# EAGLE schematic RedBoard_ESP32 (EAGLE 9.6.2)
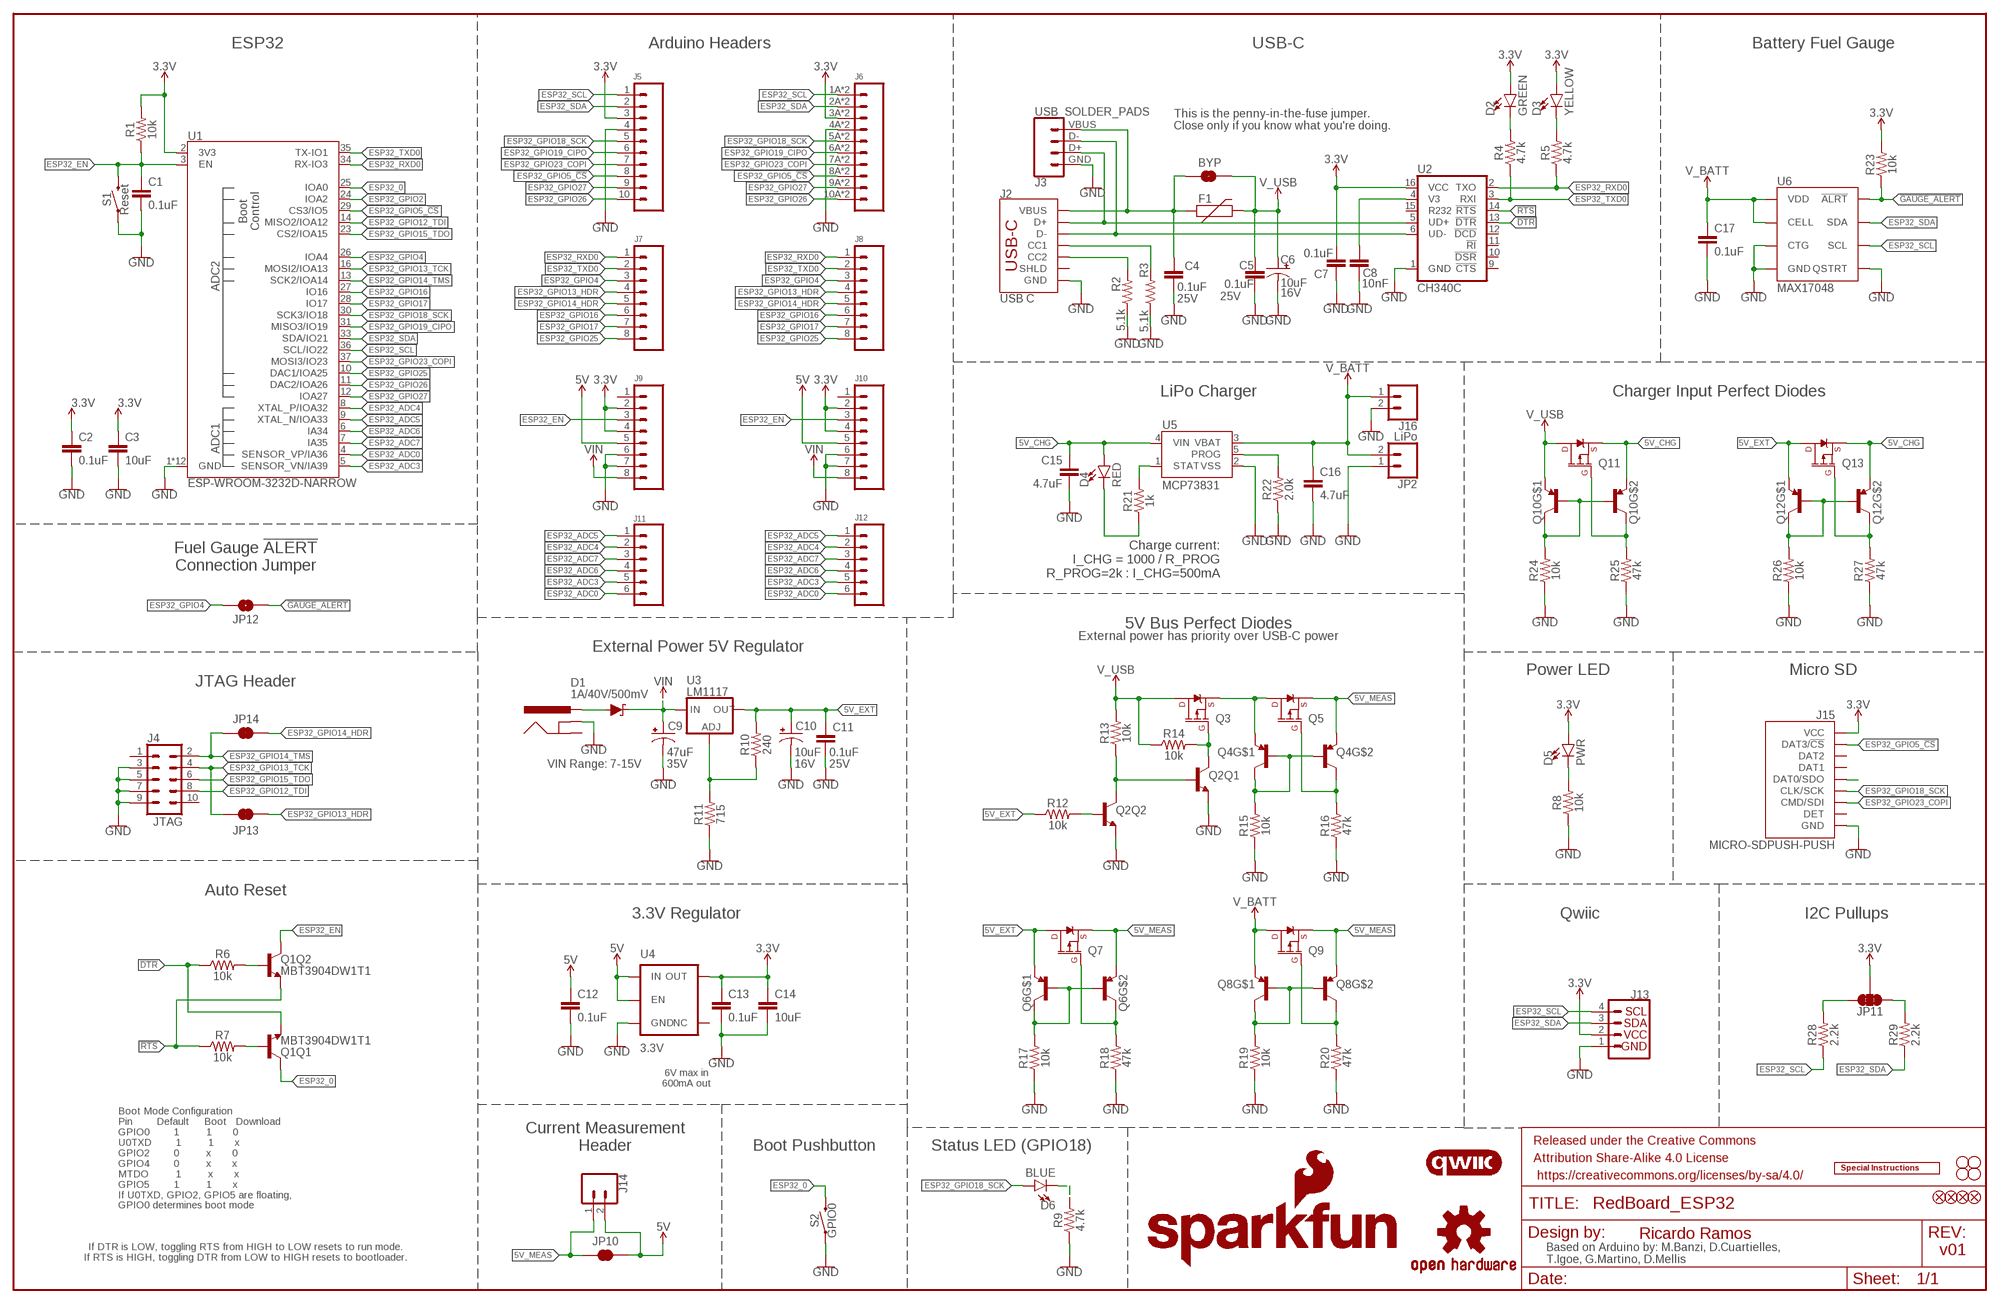
[diagram p0: schematic, sheet 1]

## Parts
BYP  JUMPER-SMT_2_NO_SILK  [SMT-JUMPER_2_NO_SILK]
C1  0.1uF  0.1UF-0603-25V-(+80/-20%)  [0603]
C2  0.1uF  0.1UF-0603-25V-(+80/-20%)  [0603]
C3  10uF  10UF-0603-6.3V-20%  [0603]
C4  0.1uF  0.1UF-0603-25V-(+80/-20%)  [0603]
C5  0.1uF  0.1UF-0603-25V-(+80/-20%)  [0603]
C6  10uF  10UF-POLAR-EIA3216-16V-10%(TANT)  [EIA3216]
C7  0.1uF  0.1UF-0603-25V-(+80/-20%)  [0603]
C8  10nF  10NF-0603-50V-10%  [0603]
C9  47uF  47UF-POLAR-PANASONIC_D-35V-20%  [PANASONIC_D]
C10  10uF  10UF-POLAR-EIA3216-16V-10%(TANT)  [EIA3216]
C11  0.1uF  0.1UF-0603-25V-(+80/-20%)  [0603]
C12  0.1uF  0.1UF-0603-25V-(+80/-20%)  [0603]
C13  0.1uF  0.1UF-0603-25V-(+80/-20%)  [0603]
C14  10uF  10UF-0603-6.3V-20%  [0603]
C15  4.7uF  4.7UF-0603-35V-(20%)  [0603]
C16  4.7uF  4.7UF-0603-35V-(20%)  [0603]
C17  0.1uF  0.1UF-0603-25V-(+80/-20%)  [0603]
D1  1A/40V/500mV  DIODE-SCHOTTKY-SS14  [SMA-DIODE]
D2  GREEN  LED-GREEN_HIDDENSILK  [LED-1206-HIDDENSILK]
D3  YELLOW  LED-YELLOW_HIDDENSILK  [LED-1206-HIDDENSILK]
D4  RED  LED-RED_HIDDENSILK  [LED-1206-HIDDENSILK]
D5  PWR  LED-GREEN_HIDDENSILK  [LED-1206-HIDDENSILK]
D6  BLUE  LED-BLUE_HIDDENSILK  [LED-1206-HIDDENSILK]
F1  6V/2A  PPTC_6V2A  [1210]
FRAME1  FRAME-LEDGER  [CREATIVE_COMMONS]
J1  5.5x2.1mm Barrel  POWER_JACKSMD  [POWER_JACK_SMD]
J2  USB C  USB_C_2-LAYER_PADS  [USB-C-16P-2LAYER-PADS]
J3  USB_SOLDER_PADS  [USB-SOLDER-PADS]
J4  CONN_05X20.05_IN_PTH_SILK  [2X5_PTH_SILK_.05]
J5  M10NO_SILK  CONN_10NO_SILK_PTH_FEMALE  [1X10_NO_SILK]
J6  CONN_10SMD_COMBO-FEMALE  [1X10_SMD_COMBINED]
J7  CONN_08NO_SILK_FEMALE_PTH  [1X08_NO_SILK]
J8  CONN_08SMD-COMBO-FEMALE  [1X08_SMD_COMBINED]
J9  CONN_08NO_SILK_FEMALE_PTH  [1X08_NO_SILK]
J10  CONN_08SMD-COMBO-FEMALE  [1X08_SMD_COMBINED]
J11  CONN_06NO_SILK_FEMALE_PTH  [1X06_NO_SILK]
J12  CONN_06SMD-STRAIGHT-COMBO-FEMALE  [1X06_SMD_STRAIGHT_COMBO]
J13  QWIIC_RIGHT_ANGLE  QWIIC_CONNECTORJS-1MM  [JST04_1MM_RA]
J14  CONN_02  [1X02]
J15  MICRO-SDPUSH-PUSH  [MICRO-SD-SOCKET]
J16  CONN_02  [1X02]
JP1  FIDUCIAL1X2  [FIDUCIAL-1X2]
JP2  LiPo  CONN_02-JST-2MM-SMT  [JST-2-SMD]
JP3  STAND-OFF  [STAND-OFF]
JP4  STAND-OFF  [STAND-OFF]
JP5  STAND-OFF  [STAND-OFF]
JP6  STAND-OFF  [STAND-OFF]
JP7  FIDUCIAL1X2  [FIDUCIAL-1X2]
JP8  FIDUCIAL1X2  [FIDUCIAL-1X2]
JP9  FIDUCIAL1X2  [FIDUCIAL-1X2]
JP10  JUMPER-SMT_2_NC_TRACE_SILK  [SMT-JUMPER_2_NC_TRACE_SILK]
JP11  JUMPER-SMT_3_2-NC_TRACE_SILK  [SMT-JUMPER_3_2-NC_TRACE_SILK]
JP12  JUMPER-SMT_2_NO_SILK  [SMT-JUMPER_2_NO_SILK]
JP13  JUMPER-SMT_2_NC_TRACE_SILK  [SMT-JUMPER_2_NC_TRACE_SILK]
JP14  JUMPER-SMT_2_NC_TRACE_SILK  [SMT-JUMPER_2_NC_TRACE_SILK]
LOGO1  SFE_LOGO_NAME.1_INCH  [SFE_LOGO_NAME_.1]
LOGO2  QWIIC_LOGO_5MM  [QWIIC_5MM]
LOGO3  OSHW-LOGOMINI  [OSHW-LOGO-MINI]
LOGO4  QWIIC_LOGO_5MM  [QWIIC_5MM]
LOGO5  SPECIAL_INSTRUCTIONS-ORDERING  [ORDERING_INSTRUCTIONS]
LOGO6  SFE_LOGO_NAME_FLAME.2_INCH  [SFE_LOGO_NAME_FLAME_.2]
Q1  MBT3904DW1T1  TRANS_NPN_DUAL-MBT3904DW1T1  [SC70-6]
Q2  TRANS_NPN_DUAL-MBT3904DW1T1  [SC70-6]
Q3  20V/4.2A/52mΩ/1.4W  MOSFET_PCH-DMG2305UX-7  [SOT23-3]
Q4  TRANS_PNP_DUALSOT-363  [SOT363_PHILIPS]
Q5  20V/4.2A/52mΩ/1.4W  MOSFET_PCH-DMG2305UX-7  [SOT23-3]
Q6  TRANS_PNP_DUALSOT-363  [SOT363_PHILIPS]
Q7  20V/4.2A/52mΩ/1.4W  MOSFET_PCH-DMG2305UX-7  [SOT23-3]
Q8  TRANS_PNP_DUALSOT-363  [SOT363_PHILIPS]
Q9  20V/4.2A/52mΩ/1.4W  MOSFET_PCH-DMG2305UX-7  [SOT23-3]
Q10  TRANS_PNP_DUALSOT-363  [SOT363_PHILIPS]
Q11  20V/4.2A/52mΩ/1.4W  MOSFET_PCH-DMG2305UX-7  [SOT23-3]
Q12  TRANS_PNP_DUALSOT-363  [SOT363_PHILIPS]
Q13  20V/4.2A/52mΩ/1.4W  MOSFET_PCH-DMG2305UX-7  [SOT23-3]
R1  10k  10KOHM-0603-1/10W-1%  [0603]
R2  5.1k  5.1KOHM5.1KOHM-0603-1/10W-1%  [0603]
R3  5.1k  5.1KOHM5.1KOHM-0603-1/10W-1%  [0603]
R4  4.7k  4.7KOHM-0603-1/10W-1%  [0603]
R5  4.7k  4.7KOHM-0603-1/10W-1%  [0603]
R6  10k  10KOHM-0603-1/10W-1%  [0603]
R7  10k  10KOHM-0603-1/10W-1%  [0603]
R8  10k  10KOHM-0603-1/10W-1%  [0603]
R9  4.7k  4.7KOHM-0603-1/10W-1%  [0603]
R10  240  240OHM-0603-1/10W-1%  [0603]
R11  715  715OHM-0603-1/10W-1%  [0603]
R12  10k  10KOHM-0603-1/10W-1%  [0603]
R13  10k  10KOHM-0603-1/10W-1%  [0603]
R14  10k  10KOHM-0603-1/10W-1%  [0603]
R15  10k  10KOHM-0603-1/10W-1%  [0603]
R16  47k  47KOHM-0603-1/10W-1%  [0603]
R17  10k  10KOHM-0603-1/10W-1%  [0603]
R18  47k  47KOHM-0603-1/10W-1%  [0603]
R19  10k  10KOHM-0603-1/10W-1%  [0603]
R20  47k  47KOHM-0603-1/10W-1%  [0603]
R21  1k  1KOHM-0603-1/10W-1%  [0603]
R22  2.0k  2.0KOHM-0603-1/10W-5%  [0603]
R23  10k  10KOHM-0603-1/10W-1%  [0603]
R24  10k  10KOHM-0603-1/10W-1%  [0603]
R25  47k  47KOHM-0603-1/10W-1%  [0603]
R26  10k  10KOHM-0603-1/10W-1%  [0603]
R27  47k  47KOHM-0603-1/10W-1%  [0603]
R28  2.2k  2.2KOHM-0603-1/10W-1%  [0603]
R29  2.2k  2.2KOHM-0603-1/10W-1%  [0603]
S1  Reset  MOMENTARY-SWITCH-SPST-SMD-5.2-TALL-REDUNDANT  [TACTILE_SWITCH_SMD_5.2MM]
S2  GPIO0  MOMENTARY-SWITCH-SPST-SMD-5.2-TALL-REDUNDANT  [TACTILE_SWITCH_SMD_5.2MM]
U1  ESP-WROOM-3232D-NARROW  [ESP-WROOM-32D-NARROW]
U2  CH340C  [SO016]
U3  LM1117  V_REG_LM1117SOT223  [SOT223]
U4  3.3V  V_REG_AP2112K-3.3V  [SOT23-5]
U5  MCP73831  [SOT23-5]
U6  MAX17048  MAX17048DFN8  [DFN-8]

## Nets
3.3V: C2.1 C3.1 C7.1 C13.1 C14.1 D2.A D3.A D5.A J5.3 J6.3A J6.3B J9.2 J9.4 J10.2 J10.4 J13.2 J15.VCC JP11.2 R1.2 R23.2 U1.2(3V3) U2.16(VCC) U4.5(OUT)
5V [power]: C12.1 J9.5 J10.5 J14.2 JP10.2 U4.1(IN) U4.3(EN)
5V_CHG: C15.1 D4.A Q10.4(E) Q11.2(S) Q12.4(E) Q13.2(S) U5.4(VIN)
5V_EXT [power]: C10.+ C11.1 Q6.1(E) Q7.3(D) Q12.1(E) Q13.3(D) R10.2 R12.1 U3.2(OUT) U3.4(OUT)
5V_MEAS: J14.1 JP10.1 Q4.4(E) Q5.2(S) Q6.4(E) Q7.2(S) Q8.4(E) Q9.2(S)
!DTR!: Q1.4(Q1:E) R6.1 U2.13(!DTR)
!GAUGE_ALERT!: JP12.1 R23.1 U6.5(!ALRT)
!RTS!: Q1.1(Q2:E) R7.1 U2.14(!RTS)
CC1: J2.A5(CC1) R3.2
CC2: J2.B5(CC2) R2.2
D+: J2.A6(D+) J2.B6(D+) J3.D+ U2.5(UD+)
D-: J2.A7(D-) J2.B7(D-) J3.D- U2.6(UD-)
ESP32_0: Q1.3(Q1:C) S2.3 S2.4 U1.25(IOA0)
ESP32_ADC0: J11.6 J12.6 U1.4(SENSOR_VP/IA36)
ESP32_ADC3: J11.5 J12.5 U1.5(SENSOR_VN/IA39)
ESP32_ADC4: J11.2 J12.2 U1.8(XTAL_P/IOA32)
ESP32_ADC5: J11.1 J12.1 U1.9(XTAL_N/IOA33)
ESP32_ADC6: J11.4 J12.4 U1.6(IA34)
ESP32_ADC7: J11.3 J12.3 U1.7(IA35)
ESP32_EN: C1.1 J9.3 J10.3 Q1.6(Q2:C) R1.1 S1.3 S1.4 U1.3(EN)
ESP32_GPIO2: U1.24(IOA2)
ESP32_GPIO4: J7.3 J8.3 JP12.2 U1.26(IOA4)
ESP32_GPIO5_!CS!: J5.8 J6.8A J6.8B J15.CS/DAT3(DAT3/!CS!) U1.29(CS3/IO5)
ESP32_GPIO12_TDI: J4.8 U1.14(MISO2/IOA12)
ESP32_GPIO13_HDR: J7.4 J8.4 JP13.2
ESP32_GPIO13_TCK: J4.4 JP13.1 U1.16(MOSI2/IOA13)
ESP32_GPIO14_HDR: J7.5 J8.5 JP14.2
ESP32_GPIO14_TMS: J4.2 JP14.1 U1.13(SCK2/IOA14)
ESP32_GPIO15_TDO: J4.6 U1.23(CS2/IOA15)
ESP32_GPIO16: J7.6 J8.6 U1.27(IO16)
ESP32_GPIO17: J7.7 J8.7 U1.28(IO17)
ESP32_GPIO18_SCK: D6.A J5.5 J6.5A J6.5B J15.SCLK(CLK/SCK) U1.30(SCK3/IO18)
ESP32_GPIO19_CIPO: J5.6 J6.6A J6.6B J15.DO/DAT0(DAT0/SDO) U1.31(MISO3/IO19)
ESP32_GPIO23_COPI: J5.7 J6.7A J6.7B J15.DI/CMD(CMD/SDI) U1.37(MOSI3/IO23)
ESP32_GPIO25: J7.8 J8.8 U1.10(DAC1/IOA25)
ESP32_GPIO26: J5.10 J6.10A J6.10B U1.11(DAC2/IOA26)
ESP32_GPIO27: J5.9 J6.9A J6.9B U1.12(IOA27)
ESP32_RXD0: J7.1 J8.1 R5.1 U1.34(RX-IO3) U2.2(TXO)
ESP32_SCL: J5.1 J6.1A J6.1B J13.4 R28.1 U1.36(SCL/IO22) U6.7(SCL)
ESP32_SDA: J5.2 J6.2A J6.2B J13.3 R29.1 U1.33(SDA/IO21) U6.8(SDA)
ESP32_TXD0: J7.2 J8.2 R4.1 U1.35(TX-IO1) U2.3(RXI)
GND: C1.2 C2.2 C3.2 C4.2 C5.2 C6.- C7.2 C8.2 C9.- C10.- C11.2 C12.2 C13.2 C14.2 C15.2 C16.2 C17.2 J1.GND(GNDBREAK) J2.GND J2.GND2(GND) J3.GND J4.3 J4.5 J4.7 J4.9 J5.4 J6.4A J6.4B J9.6 J9.7 J10.6 J10.7 J13.1 J15.GND J15.GND1(GND) J15.GND3(GND) J16.2 JP2.1 Q2.1(Q2:E) Q2.4(Q1:E) R2.1 R3.1 R8.1 R9.1 R11.1 R15.1 R16.1 R17.1 R18.1 R19.1 R20.1 R22.1 R24.1 R25.1 R26.1 R27.1 S1.1 S1.2 S2.1 S2.2 U1.1(GND) U1.15(GND) U1.38(GND) U1.GND1(GND) U1.GNDT1(GND) U1.GNDT2(GND) U1.GNDT3(GND) U1.GNDT4(GND) U1.GNDT5(GND) U1.GNDT6(GND) U1.GNDT7(GND) U1.GNDT8(GND) U2.1(GND) U4.2(GND) U5.2(VSS) U6.1(CTG) U6.4(GND) U6.6(QSTRT) U6.9(GND)
N$1: R21.2 U5.1(STAT)
N$2: D5.C R8.2
N$3: D6.C R9.2
N$4: D4.C R21.1
N$5: D2.C R4.2
N$6: C8.1 U2.4(V3)
N$7: D3.C R5.2
N$8: Q6.2(B) Q6.5(B) Q6.6(C) R17.2
N$10: Q6.3(C) Q7.1(G) R18.2
N$12: Q4.2(B) Q4.5(B) Q4.6(C) R15.2
N$13: Q8.2(B) Q8.5(B) Q8.6(C) R19.2
N$14: R22.2 U5.5(PROG)
N$15: R10.1 R11.2 U3.1(ADJ)
N$16: Q4.3(C) Q5.1(G) R16.2
N$17: Q8.3(C) Q9.1(G) R20.2
N$18: JP11.3 R28.2
N$19: Q2.3(Q1:C) Q3.1(G) R14.2
N$20: JP11.1 R29.2
N$21: Q2.2(Q2:B) R12.2
N$22: Q2.5(Q1:B) Q2.6(Q2:C) R13.1
N$23: Q10.3(C) Q11.1(G) R25.2
N$24: Q1.5(Q1:B) R7.2
N$25: Q1.2(Q2:B) R6.2
N$26: Q10.2(B) Q10.5(B) Q10.6(C) R24.2
N$28: Q12.3(C) Q13.1(G) R27.2
N$29: Q12.2(B) Q12.5(B) Q12.6(C) R26.2
PWRIN [power]: D1.A J1.VIN0(PWR)
V_BATT: C16.1 C17.1 J16.1 JP2.2 Q8.1(E) Q9.3(D) U5.3(VBAT) U6.2(CELL) U6.3(VDD)
V_USB: BYP.2 C5.1 C6.+ F1.2 Q3.3(D) Q10.1(E) Q11.3(D) R13.2 R14.1
VIN [power]: C9.+ D1.C J9.8 J10.8 U3.3(IN)
VUSB [power]: BYP.1 C4.1 F1.1 J2.VBUS1(VBUS) J2.VBUS2(VBUS) J3.VBUS
VUSB_PROT: Q3.2(S) Q4.1(E) Q5.3(D)
Unconnected: J1.P$4(GND) J2.SHLD1(SHLD) J2.SHLD2(SHLD) J2.SHLD3(SHLD) J2.SHLD4(SHLD) J4.1 J4.10 J9.1 J10.1 J15.CD1(DET) J15.DAT1 J15.DAT2 U2.9(!CTS) U2.10(!DSR) U2.11(!RI) U2.12(!DCD) U2.15(R232) U4.4(NC)

## Notes on the sheet
- ESP32 | Arduino Headers | USB-C | Battery Fuel Gauge
- J5 | J6
- This is the penny-in-the-fuse jumper.
  Close only if you know what you're doing.
- J7 | J8
- 16V
- 25V | 25V
- J9 | J10
- LiPo Charger | Charger Input Perfect Diodes
- J11 | J12
- Charge current:
  I_CHG = 1000 / R_PROG
  R_PROG=2k : I_CHG=500mA
- Fuel Gauge !ALERT!
  Connection Jumper
- 5V Bus Perfect Diodes
- External power has priority over USB-C power
- External Power 5V Regulator
- Power LED | Micro SD
- JTAG Header
- VIN Range: 7-15V | 35V | 16V | 25V
- JTAG
- Auto Reset
- 3.3V Regulator | Qwiic | I2C Pullups
- 6V max in
  600mA out
- Current Measurement
  Header
- Boot Pushbutton | Status LED (GPIO18)
- Boot Mode Configuration
  Pin        Default     Boot   Download
  GPIO0        1         1       0
  U0TXD        1         1       x
  GPIO2        0         x       0
  GPIO4        0         x       x
  MTDO         1         x       x
  GPIO5        1         1       x
  If U0TXD, GPIO2, GPIO5 are floating, 
  GPIO0 determines boot mode
- Ricardo Ramos
- If DTR is LOW, toggling RTS from HIGH to LOW resets to run mode.
  If RTS is HIGH, toggling DTR from LOW to HIGH resets to bootloader.
- v01
- Based on Arduino by: M.Banzi, D.Cuartielles, 
  T.Igoe, G.Martino, D.Mellis

## Library data of the parts
BYP JP12 = SparkFun-Jumpers:JUMPER-SMT_2_NO: Normally open jumper This jumper has two pads in close proximity to each other. Apply solder to close the connection. Round pads are easier to solder for beginners, but are a lot larger. SparkFun Product that uses the round pads: SparkFun EL Sequencer <https://www.sparkfun.com/products/12781>
C1 C2 C4 C5 C7 C11-C13 C17 = SparkFun-Capacitors:0.1UF: 0.1µF ceramic capacitors A capacitor is a passive two-terminal electrical component used to store electrical energy temporarily in an electric field.; PROD_ID: CAP-00810
C3 C14 = SparkFun-Capacitors:10UF: 10.0µF ceramic capacitors A capacitor is a passive two-terminal electrical component used to store electrical energy temporarily in an electric field.; PROD_ID: CAP-11015
C6 C10 = SparkFun-Capacitors:10UF-POLAR: 10.0µF polarized capacitors A capacitor is a passive two-terminal electrical component used to store electrical energy temporarily in an electric field.; PROD_ID: CAP-00811
C8 = SparkFun-Capacitors:10NF: 0.01uF/10nF/10,000pF ceramic capacitors A capacitor is a passive two-terminal electrical component used to store electrical energy temporarily in an electric field. CAP-09321; PROD_ID: CAP-00867
C9 = SparkFun-Capacitors:47UF-POLAR: 47µF polarized capacitors A capacitor is a passive two-terminal electrical component used to store electrical energy temporarily in an electric field.; PROD_ID: CAP-08478
C15 C16 = SparkFun-Capacitors:4.7UF: 4.7µF ceramic capacitors A capacitor is a passive two-terminal electrical component used to store electrical energy temporarily in an electric field.; PROD_ID: CAP-14106
D1 = SparkFun-DiscreteSemi:DIODE-SCHOTTKY: Schottky diode A Schottky diode is a semiconductor diode which has a low forward voltage drop and a very fast switching action.; PROD_ID: DIO-08053
D2 = SparkFun-LED:LED-GREEN: Green SMD LED Used in manufacturing of various products at SparkFun Packages: 0603 - SMD 0603 package [Product Link] <http://www.futureelectronics.com/en/technologies/semiconductors/optoelectronics/leds/Pages/9894312-LTST-C190GKT.aspx?CrossPart=HSMG-C190&IM=0> LilyPad 1206 - SMD1206 LilyPad package [Product Link] <http://www.futureelectronics.com/en/Technologies/Product.aspx?ProductID=IN150NGHARVATEKCORPORATION2049943&IM=0> 1206 - SMD1206 package [Product Link] <http://www.futureelectronics.com/en/technologies/semiconductors/optoelectronics/leds/Pages/8315665-LTST-C150KGKT.aspx?IM=0> 1206 Bottom Mount -SMD 1206 Bottom Mount [Product Link] <http://www.digikey.com/product-detail/en/lite-on-inc/LTST-C230KGKT/160-1456-1-ND/386854> SparkFun Products: Pro Mini 328 -5V <https://www.sparkfun.com/products/821> RedBoard <https://www.sparkfun.com/products/12757> MP3 Trigger <https://www.sparkfun.com/products/13720> Makey Makey <https://www.sparkfun.com/products/11076>; PROD_ID: DIO-00862
D3 = SparkFun-LED:LED-YELLOW: Yellow SMD LED Used in manufacturing several products at SparkFun. Packages: 0603 - SMD 0603 package[Product Link] <http://www.kingbrightusa.com/product.asp?catalog_name=LED&product_id=APT1608SYCK> 0603 -SMART - SMART SMD 0603 package (more efficient/more expensive) [Product Link] <http://www.osram-os.com/osram_os/en/products/product-catalog/led-light-emitting-diodes/smartled-0603/ly-l29k/index.jsp> LilyPad - SMD1206 package[Product Datasheet] <https://www.sparkfun.com/datasheets/DevTools/LilyPad/Q150YUS4.pdf> SparkFun Products: Blynk Board <https://www.sparkfun.com/products/13794> IOIO-OTG <https://www.sparkfun.com/products/13613> XBee Explorer Serial <https://www.sparkfun.com/products/13225>; PROD_ID: DIO-09909
D4 = SparkFun-LED:LED-RED: Red SMD LED Used in manufacturing of most products at SparkFun Packages: 0603 - SMD 0603 package [Product Link] <http://docs.avagotech.com/docs/AV02-0551EN> 0603 SMART - SMD 0603 SMART package ( more efficient and expensive)[Product Link] <http://www.osram-os.com/Graphics/XPic2/00077099_0.pdf> 1206 - SMD1206 package [Product Link] <https://www.sparkfun.com/datasheets/DevTools/LilyPad/Q150OVS4.pdff> SparkFun Products: Pro Mini 328 -5V <https://www.sparkfun.com/products/821> RedBoard <https://www.sparkfun.com/products/12757> IOIO-OTG <https://www.sparkfun.com/products/13613>; PROD_ID: DIO-09912
D5 = SparkFun-LED:LED-GREEN: Green SMD LED Used in manufacturing of various products at SparkFun Packages: 0603 - SMD 0603 package [Product Link] <http://www.futureelectronics.com/en/technologies/semiconductors/optoelectronics/leds/Pages/9894312-LTST-C190GKT.aspx?CrossPart=HSMG-C190&IM=0> LilyPad 1206 - SMD1206 LilyPad package [Product Link] <http://www.futureelectronics.com/en/Technologies/Product.aspx?ProductID=IN150NGHARVATEKCORPORATION2049943&IM=0> 1206 - SMD1206 package [Product Link] <http://www.futureelectronics.com/en/technologies/semiconductors/optoelectronics/leds/Pages/8315665-LTST-C150KGKT.aspx?IM=0> 1206 Bottom Mount -SMD 1206 Bottom Mount [Product Link] <http://www.digikey.com/product-detail/en/lite-on-inc/LTST-C230KGKT/160-1456-1-ND/386854> SparkFun Products: Pro Mini 328 -5V <https://www.sparkfun.com/products/821> RedBoard <https://www.sparkfun.com/products/12757> MP3 Trigger <https://www.sparkfun.com/products/13720> Makey Makey <https://www.sparkfun.com/products/11076>; PROD_ID: DIO-00862; VALUE: GREEN
D6 = SparkFun-LED:LED-BLUE: Blue SMD LED Used in manufacturing of various products at SparkFun Packages: 0603 - SMD 0603 package [Product Link] <http://www.digikey.com/product-detail/en/SMLE12BC7TT86/511-1589-2-ND/1641808> 1206 - SMD1206 package [Product Link] <http://www.digikey.com/product-detail/en/lite-on-inc/LTST-C150TBKT/160-1643-1-ND/573584> SparkFun Products: ESP8266 Thing-Dev Board <https://www.sparkfun.com/products/13711> RedBoard <https://www.sparkfun.com/products/12757>; PROD_ID: DIO-09911
F1 = SparkFun-Fuses:PPTC: Resettable Fuse PPTC Resettable Fuse. Really a sort of resistor with a polymeric positive temperature coefficient whose resistance increases dramatically with an increase in temperature. When heated by the power passing through the resistance rises causing the current to be limited, protecting the circuit. This is achieved by the transition of the polymer from a crystalline to an amorphous state where the conductive carbon separates breaking the conductive pathways found in the cool crystalline structure. When a PPTC cools back down it resumes conducting letting the circuit turn back on. SparkFun Products: SparkFun RedBoard - Programmed with Arduino <https://www.sparkfun.com/products/12757> Pro Micro - 5V/16MHz <https://www.sparkfun.com/products/12640> Arduino Pro 328 - 5V/16MHz <https://www.sparkfun.com/products/10915> MP3 Trigger <https://www.sparkfun.com/products/13720>; PROD_ID: RES-14313
FRAME1 = SparkFun-Aesthetics:FRAME-LEDGER: Schematic Frame - Ledger Standard 11x14 US Ledger frame
J1 = SparkFun-Connectors:POWER_JACK: Power Jack Connector This is the standard 5.5mm barrel jack for power. The PTH is the most common, proven, reliable, footprint. The Slot footprint only works if the mill layer is transmitted to the PCB fab house so be warned. Here are the connectors we sell at SparkFun: DC Barrel Power Jack/Connector <https://www.sparkfun.com/products/119> (PRT-00119) DC Barrel Power Jack/Connector (SMD) <https://www.sparkfun.com/products/12748> (PRT-12748) DC Barrel Jack Adapter - Breadboard Compatible <https://www.sparkfun.com/products/10811> (PRT-10811) It is used on this SparkFun product (and many, many others): SparkFun RedBoard - Programmed with Arduino <https://www.sparkfun.com/products/12757> (DEV-12757) Also, if you need a mating power supply or connector, please check these out: Wall Adapter Power Supply - 9VDC 650mA <https://www.sparkfun.com/products/298> (TOL-00298) DC Barrel Jack Adapter - Male <https://www.sparkfun.com/products/10287> (PRT-10287); PROD_ID: CONN-08106; SF_ID: PRT-12748
J2 = SparkFun-Connectors:USB_C: USB Type C 16Pin Connector Super Speed pins not available on the 16-pin purely SMD connector so this part is best for USB 2.0 implementations. D1 and D2 are tied together enabling D+/- no matter which way the cable is plugged into the connector. The two channel configuration pins (CC1/2) are exposed. These are normally connected to ground via 5.1k resistors but can be reconfigured for high current/high power applications. **4-LAYER BOARD WARNING!!** If designing 4-layer board, make sure to select the variant _4-LAYER-ISOLATED. The linked footprint (USB-C-16-4LAYER-ISOLATED) includes some very necessary cutout polygons in the inner layers (2 and 15). This prevents the PTH mounting shield legs on the USB connector from electrically connecting any other polygons on the inner layers (usually VCC and GND).; PROD_ID: CONN-14122
J3 = SparkFun-Connectors:USB_SOLDER_PADS: Solder pad access to USB pins. Helpful to expose on PCBs so user can attach external USB connector if necessary.
J4 = SparkFun-Connectors:CONN_05X2: Multi connection point. Often used as Generic Header-pin footprint for 0.1 inch spaced/style header connections For AVR SPI programming port, see special device with nice symbol: "AVR_SPI_PROG_5x2.dev" You can populate with any combo of single row headers, but if you'd like an exact match, check these: 2x5 AVR ICSP Male Header <https://www.sparkfun.com/products/778> (PRT-00778) 2x5 Pin Shrouded Header <https://www.sparkfun.com/products/8506> (PRT-08506) On any of the 0.1 inch spaced packages, you can populate with these: Break Away Headers - Straight <https://www.sparkfun.com/products/116> (PRT-00116) Break Away Male Headers - Right Angle <https://www.sparkfun.com/products/553> (PRT-00553) Female Headers <https://www.sparkfun.com/products/115> (PRT-00115) Break Away Headers - Machine Pin <https://www.sparkfun.com/products/117> (PRT-00117) Break Away Female Headers - Swiss Machine Pin <https://www.sparkfun.com/products/743> (PRT-00743) Special note: the shrouded connector mates well with our 5x2 ribbon cables: 2x5 Pin IDC Ribbon Cable <https://www.sparkfun.com/products/8535> (PRT-08535)
J5 J6 = SparkFun-Connectors:CONN_10: Multi connection point. Often used as Generic Header-pin footprint for 0.1 inch spaced/style header connections On any of the 0.1 inch spaced packages, you can populate with these: Break Away Headers - Straight <https://www.sparkfun.com/products/116> (PRT-00116) Break Away Male Headers - Right Angle <https://www.sparkfun.com/products/553> (PRT-00553) Female Headers <https://www.sparkfun.com/products/115> (PRT-00115) Break Away Headers - Machine Pin <https://www.sparkfun.com/products/117> (PRT-00117) Break Away Female Headers - Swiss Machine Pin <https://www.sparkfun.com/products/743> (PRT-00743) Arduino Stackable Header - 10 Pin <https://www.sparkfun.com/products/11376> (PRT-11376) For SCREWTERMINALS and SPRING TERMINALS visit here: Screw Terimnals on SparkFun.com <https://www.sparkfun.com/search/results?term=Screw+Terminals> (5mm/3.5mm/2.54mm spacing) This device is also useful as a general connection point to wire up your design to another part of your project. Our various solder wires solder well into these plated through hole pads. Hook-Up Wire - Assortment (Stranded, 22 AWG) <https://www.sparkfun.com/products/11375> (PRT-11375) Hook-Up Wire - Assortment (Solid Core, 22 AWG) <https://www.sparkfun.com/products/11367> (PRT-11367) View the entire wire category on our website here <https://www.sparkfun.com/categories/141> Special notes: Molex polarized connector foot print use with SKU : PRT-08231 with associated crimp pins and housings. 1MM SMD Version SKU: PRT-10208 NOTES ON THE VARIANTS LOCK and LOCK_LONGPADS... This footprint was designed to help hold the alignment of a through-hole component (i.e. 6-pin header) while soldering it into place. You may notice that each hole has been shifted either up or down by 0.005 of an inch from it's more standard position (which is a perfectly straight line). This slight alteration caused the pins (the squares in the middle) to touch the edges of the holes. Because they are alternating, it causes a "brace" to hold the component in place. 0.005 has proven to be the perfect amount of "off-center" position when using our standard breakaway headers. Although looks a little odd when you look at the bare footprint, once you have a header in there, the alteration is very hard to notice. Also,if you push a header all the way into place, it is covered up entirely on the bottom side.; PROD_ID: CONN-11219
J7 J9 = SparkFun-Connectors:CONN_08: Multi connection point. Often used as Generic Header-pin footprint for 0.1 inch spaced/style header connections On any of the 0.1 inch spaced packages, you can populate with these: Break Away Headers - Straight <https://www.sparkfun.com/products/116> (PRT-00116) Break Away Male Headers - Right Angle <https://www.sparkfun.com/products/553> (PRT-00553) Female Headers <https://www.sparkfun.com/products/115> (PRT-00115) Break Away Headers - Machine Pin <https://www.sparkfun.com/products/117> (PRT-00117) Break Away Female Headers - Swiss Machine Pin <https://www.sparkfun.com/products/743> (PRT-00743) Arduino Stackable Header - 8 Pin <https://www.sparkfun.com/products/9279> (PRT-09279) For SCREWTERMINALS and SPRING TERMINALS visit here: Screw Terimnals on SparkFun.com <https://www.sparkfun.com/search/results?term=Screw+Terminals> (5mm/3.5mm/2.54mm spacing) This device is also useful as a general connection point to wire up your design to another part of your project. Our various solder wires solder well into these plated through hole pads. Hook-Up Wire - Assortment (Stranded, 22 AWG) <https://www.sparkfun.com/products/11375> (PRT-11375) Hook-Up Wire - Assortment (Solid Core, 22 AWG) <https://www.sparkfun.com/products/11367> (PRT-11367) View the entire wire category on our website here <https://www.sparkfun.com/categories/141> Special notes: Molex polarized connector foot print use with SKU : PRT-08231 with associated crimp pins and housings. 1MM SMD Version SKU: PRT-10208 NOTES ON THE VARIANTS LOCK and LOCK_LONGPADS... This footprint was designed to help hold the alignment of a through-hole component (i.e. 6-pin header) while soldering it into place. You may notice that each hole has been shifted either up or down by 0.005 of an inch from it's more standard position (which is a perfectly straight line). This slight alteration caused the pins (the squares in the middle) to touch the edges of the holes. Because they are alternating, it causes a "brace" to hold the component in place. 0.005 has proven to be the perfect amount of "off-center" position when using our standard breakaway headers. Although looks a little odd when you look at the bare footprint, once you have a header in there, the alteration is very hard to notice. Also,if you push a header all the way into place, it is covered up entirely on the bottom side.; PROD_ID: CONN-08438
J8 J10 = SparkFun-Connectors:CONN_08: Multi connection point. Often used as Generic Header-pin footprint for 0.1 inch spaced/style header connections On any of the 0.1 inch spaced packages, you can populate with these: Break Away Headers - Straight <https://www.sparkfun.com/products/116> (PRT-00116) Break Away Male Headers - Right Angle <https://www.sparkfun.com/products/553> (PRT-00553) Female Headers <https://www.sparkfun.com/products/115> (PRT-00115) Break Away Headers - Machine Pin <https://www.sparkfun.com/products/117> (PRT-00117) Break Away Female Headers - Swiss Machine Pin <https://www.sparkfun.com/products/743> (PRT-00743) Arduino Stackable Header - 8 Pin <https://www.sparkfun.com/products/9279> (PRT-09279) For SCREWTERMINALS and SPRING TERMINALS visit here: Screw Terimnals on SparkFun.com <https://www.sparkfun.com/search/results?term=Screw+Terminals> (5mm/3.5mm/2.54mm spacing) This device is also useful as a general connection point to wire up your design to another part of your project. Our various solder wires solder well into these plated through hole pads. Hook-Up Wire - Assortment (Stranded, 22 AWG) <https://www.sparkfun.com/products/11375> (PRT-11375) Hook-Up Wire - Assortment (Solid Core, 22 AWG) <https://www.sparkfun.com/products/11367> (PRT-11367) View the entire wire category on our website here <https://www.sparkfun.com/categories/141> Special notes: Molex polarized connector foot print use with SKU : PRT-08231 with associated crimp pins and housings. 1MM SMD Version SKU: PRT-10208 NOTES ON THE VARIANTS LOCK and LOCK_LONGPADS... This footprint was designed to help hold the alignment of a through-hole component (i.e. 6-pin header) while soldering it into place. You may notice that each hole has been shifted either up or down by 0.005 of an inch from it's more standard position (which is a perfectly straight line). This slight alteration caused the pins (the squares in the middle) to touch the edges of the holes. Because they are alternating, it causes a "brace" to hold the component in place. 0.005 has proven to be the perfect amount of "off-center" position when using our standard breakaway headers. Although looks a little odd when you look at the bare footprint, once you have a header in there, the alteration is very hard to notice. Also,if you push a header all the way into place, it is covered up entirely on the bottom side.; PROD_ID: CONN-10204; SF_ID: PRT-11543
J11 = SparkFun-Connectors:CONN_06: Multi connection point. Often used as Generic Header-pin footprint for 0.1 inch spaced/style header connections On any of the 0.1 inch spaced packages, you can populate with these: Break Away Headers - Straight <https://www.sparkfun.com/products/116> (PRT-00116) Break Away Male Headers - Right Angle <https://www.sparkfun.com/products/553> (PRT-00553) Female Headers <https://www.sparkfun.com/products/115> (PRT-00115) Break Away Headers - Machine Pin <https://www.sparkfun.com/products/117> (PRT-00117) Break Away Female Headers - Swiss Machine Pin <https://www.sparkfun.com/products/743> (PRT-00743) Arduino Stackable Header - 6 Pin <https://www.sparkfun.com/products/9280> (PRT-09280) For SCREWTERMINALS and SPRING TERMINALS visit here: Screw Terimnals on SparkFun.com <https://www.sparkfun.com/search/results?term=Screw+Terminals> (5mm/3.5mm/2.54mm spacing) This device is also useful as a general connection point to wire up your design to another part of your project. Our various solder wires solder well into these plated through hole pads. Hook-Up Wire - Assortment (Stranded, 22 AWG) <https://www.sparkfun.com/products/11375> (PRT-11375) Hook-Up Wire - Assortment (Solid Core, 22 AWG) <https://www.sparkfun.com/products/11367> (PRT-11367) View the entire wire category on our website here <https://www.sparkfun.com/categories/141>; PROD_ID: CONN-08437
J12 = SparkFun-Connectors:CONN_06: Multi connection point. Often used as Generic Header-pin footprint for 0.1 inch spaced/style header connections On any of the 0.1 inch spaced packages, you can populate with these: Break Away Headers - Straight <https://www.sparkfun.com/products/116> (PRT-00116) Break Away Male Headers - Right Angle <https://www.sparkfun.com/products/553> (PRT-00553) Female Headers <https://www.sparkfun.com/products/115> (PRT-00115) Break Away Headers - Machine Pin <https://www.sparkfun.com/products/117> (PRT-00117) Break Away Female Headers - Swiss Machine Pin <https://www.sparkfun.com/products/743> (PRT-00743) Arduino Stackable Header - 6 Pin <https://www.sparkfun.com/products/9280> (PRT-09280) For SCREWTERMINALS and SPRING TERMINALS visit here: Screw Terimnals on SparkFun.com <https://www.sparkfun.com/search/results?term=Screw+Terminals> (5mm/3.5mm/2.54mm spacing) This device is also useful as a general connection point to wire up your design to another part of your project. Our various solder wires solder well into these plated through hole pads. Hook-Up Wire - Assortment (Stranded, 22 AWG) <https://www.sparkfun.com/products/11375> (PRT-11375) Hook-Up Wire - Assortment (Solid Core, 22 AWG) <https://www.sparkfun.com/products/11367> (PRT-11367) View the entire wire category on our website here <https://www.sparkfun.com/categories/141>; PROD_ID: CONN-10203
J13 = SparkFun-Connectors:QWIIC_CONNECTOR: SparkFun I2C Standard Qwiic Connector An SMD 1mm pitch JST connector makes it easy and quick (get it? Qwiic?) to connect I2C devices to each other. The Qwiic system <http://www.sparkfun.com/qwiic> enables fast and solderless connection between popular platforms and various sensors and actuators. We carry 200mm <https://www.sparkfun.com/products/14204>, 100mm <https://www.sparkfun.com/products/14205>, 50mm <https://www.sparkfun.com/products/14206>, and breadboard friendly <https://www.sparkfun.com/products/14207> Qwiic cables. We also offer 10 pcs strips <https://www.sparkfun.com/products/14323> the SMD connectors.; PROD_ID: CONN-13694
J14 J16 = SparkFun-Connectors:CONN_02: Multi connection point. Often used as Generic Header-pin footprint for 0.1 inch spaced/style header connections On any of the 0.1 inch spaced packages, you can populate with these: Break Away Headers - Straight <https://www.sparkfun.com/products/116> (PRT-00116) Break Away Male Headers - Right Angle <https://www.sparkfun.com/products/553> (PRT-00553) Female Headers <https://www.sparkfun.com/products/115> (PRT-00115) Break Away Headers - Machine Pin <https://www.sparkfun.com/products/117> (PRT-00117) Break Away Female Headers - Swiss Machine Pin <https://www.sparkfun.com/products/743> (PRT-00743) For SCREWTERMINALS and SPRING TERMINALS visit here: Screw Terimnals on SparkFun.com <https://www.sparkfun.com/search/results?term=Screw+Terminals> (5mm/3.5mm/2.54mm spacing) This device is also useful as a general connection point to wire up your design to another part of your project. Our various solder wires solder well into these plated through hole pads. Hook-Up Wire - Assortment (Stranded, 22 AWG) <https://www.sparkfun.com/products/11375> (PRT-11375) Hook-Up Wire - Assortment (Solid Core, 22 AWG) <https://www.sparkfun.com/products/11367> (PRT-11367) View the entire wire category on our website here <https://www.sparkfun.com/categories/141> Special notes: Molex polarized connector foot print use with: PRT-08233 with associated crimp pins and housings. 2.54_SCREWTERM for use with PRT-10571. 3.5mm Screw Terminal footprints for PRT-08084 5mm Screw Terminal footprints for use with PRT-08432
J15 = SparkFun-Connectors:MICRO-SD: microSD Socket for Transflash Various sockets for µSD. tDoc lines correctly indicate media card edge positions when inserting (unlocked, locked, depressed). NOTE: CD1 and CD2 are connected internally, and the default detect state of the socket is detect pin to ground. SparkFun Products: WAV Trigger <https://www.sparkfun.com/products/13660> CAN-Bus Shield <https://www.sparkfun.com/products/13262> SparkFun Level Shifing microSD Breakout <https://www.sparkfun.com/products/13743>; PROD_ID: CONN-07820
JP1 JP7-JP9 = SparkFun-Aesthetics:FIDUCIAL: Fiducial Alignment Points Point-of-reference for pick-and-place machines and other optical instruments.
JP2 = SparkFun-Connectors:CONN_02: Multi connection point. Often used as Generic Header-pin footprint for 0.1 inch spaced/style header connections On any of the 0.1 inch spaced packages, you can populate with these: Break Away Headers - Straight <https://www.sparkfun.com/products/116> (PRT-00116) Break Away Male Headers - Right Angle <https://www.sparkfun.com/products/553> (PRT-00553) Female Headers <https://www.sparkfun.com/products/115> (PRT-00115) Break Away Headers - Machine Pin <https://www.sparkfun.com/products/117> (PRT-00117) Break Away Female Headers - Swiss Machine Pin <https://www.sparkfun.com/products/743> (PRT-00743) For SCREWTERMINALS and SPRING TERMINALS visit here: Screw Terimnals on SparkFun.com <https://www.sparkfun.com/search/results?term=Screw+Terminals> (5mm/3.5mm/2.54mm spacing) This device is also useful as a general connection point to wire up your design to another part of your project. Our various solder wires solder well into these plated through hole pads. Hook-Up Wire - Assortment (Stranded, 22 AWG) <https://www.sparkfun.com/products/11375> (PRT-11375) Hook-Up Wire - Assortment (Solid Core, 22 AWG) <https://www.sparkfun.com/products/11367> (PRT-11367) View the entire wire category on our website here <https://www.sparkfun.com/categories/141> Special notes: Molex polarized connector foot print use with: PRT-08233 with associated crimp pins and housings. 2.54_SCREWTERM for use with PRT-10571. 3.5mm Screw Terminal footprints for PRT-08084 5mm Screw Terminal footprints for use with PRT-08432; PROD_ID: CONN-11443
JP3-JP6 = SparkFun-Hardware:STAND-OFF: Stand Off Drill holes for mechanically mounting via screws, standoffs, etc. Note: Use the keepout ring to avoid running the screw head into surrounding components. Variant Overviews STAND-OFF - Mechanical footprint for a #4 phillips button head screw. STAND-OFF-TIGHT - Mechanical footprint for a #4 phillips button head screw, Example SparkFun Products Screw - Phillips Head (1/4", 4-40, 10 pack) <https://www.sparkfun.com/products/10453> (PRT-10453) Screw - Phillips Head (1/2", 4-40, 10 pack) <https://www.sparkfun.com/products/10452> (PRT-10452) Screw - Phillips Head (3/4", 4-40, 10 pack) <https://www.sparkfun.com/products/10451> (PRT-10451) Screw - Phillips Head (1", 4-40, 10 pack) <https://www.sparkfun.com/products/10450> (PRT-10450)
JP10 JP13 JP14 = SparkFun-Jumpers:JUMPER-SMT_2_NC_TRACE: Normally closed trace jumper This jumper has a trace between two pads so it's normally closed (NC). Use a razor knife to open the connection. For best results follow the IPC guidelines for cutting traces: Cutout at least 0.063 mm (0.005 in). Remove all loose material to clean up the cut area. Seal the cut with an approved epoxy. Reapply solder to reclose the connection.
JP11 = SparkFun-Jumpers:JUMPER-SMT_3_2-NC_TRACE: Normally closed trace jumper (2 of 2 connections) This jumper has a trace between all three pads so they are normally closed (NC). Use a razor knife to open the connection(s). For best results follow the IPC guidelines for cutting traces: Cutout at least 0.063 mm (0.005 in). Remove all loose material to clean up the cut area. Seal the cut with an approved epoxy. Reapply solder to reclose the connection(s).
LOGO1 = SparkFun-Aesthetics:SFE_LOGO_NAME: SparkFun Font Logo This is the SparkFun name logo. The logo on the schematic will always be the same size; the package variant is the height of the flame part of the logo (or the height the flame would be, if it were drawn). Default layer for the logo on the board is tSilk.
LOGO2 LOGO4 = SparkFun-Aesthetics:QWIIC_LOGO: Qwiic Logos for placement on schematic and PCB. The 5.5mm silk logo is best for placing next to Qwiic connector.
LOGO3 = SparkFun-Aesthetics:OSHW-LOGO: Open-Source Hardware (OSHW) Logo This logo indicates the piece of hardware it is found on incorporates a OSHW license and/or adheres to the definition of open source hardware found here: http://freedomdefined.org/OSHW
LOGO5 = SparkFun-Aesthetics:SPECIAL_INSTRUCTIONS: Special Ordering/Production Instructions Alert Symbol for special PCB ordering instructions or unique production process warnings. Ordering Instructions Production Instructions Types of information that should be added to box: Copper weight Soldermask color Silk color PCB thickness Number of layers PCB Standard: 1.6mm FR4 1 oz copper immersion silver plating red soldermask white silkscreen Types of information that should be added to box: Special wash requirements Depaneling instructions Humidification Glue curing Default text settings: 0.07 inch 9% ratio 50% line distance
LOGO6 = SparkFun-Aesthetics:SFE_LOGO_NAME_FLAME: SparkFun Font Logo w/ Flame This is the SparkFun full logo. The logo on the schematic will always be the same size; the package variant is the height of the flame part of the logo. Default layer for the logo on the board is tSilk.
Q1 Q2 = SparkFun-DiscreteSemi:TRANS_NPN_DUAL: Dual NPN Transistors in Single Package The MBT3904W1 puts two general purpose 3904 NPN transistors in a single package. Datasheet <http://www.onsemi.com/pub_link/Collateral/MBT3904DW1T1-D.PDF> SparkFun Products: SparkFun ESP32 Thing <https://www.sparkfun.com/products/13907>; PROD_ID: TRANS-13337
Q3 Q5 Q7 Q9 Q11 Q13 = SparkFun-DiscreteSemi:MOSFET_PCH: P-channel MOSFETs Voltage controlled devices that allow control of high current outputs. SparkFun Products: SparkFun ESP32 Thing <https://www.sparkfun.com/products/13907> SparkFun ESP8266 Thing <https://www.sparkfun.com/products/13231> SparkFun Pi Servo HAT V2 <https://www.sparkfun.com/products/15316> DMG2305UX-7 (20V/4.2A/SOT23-3); PROD_ID: TRANS-14388
Q4 Q6 Q8 Q10 Q12 = SparkFun-DiscreteSemi:TRANS_PNP_DUAL: Dual PNP Transistors in Single Package The BCM857BS puts two PNP transistors in a single package. Bipolar (BJT) Transistor Array 2 PNP (Dual) 45V 100mA 100MHz 200mW Surface Mount SOT-363 Datasheet <https://www.diodes.com/assets/Datasheets/BCM857BS.pdf> SparkFun Products: SparkFun Pi Servo HAT V2 <https://www.sparkfun.com>; PROD_ID: TRANS-14386
R1 R6-R8 R12-R15 R17 R19 R23 R24 R26 = SparkFun-Resistors:10KOHM: 10kΩ resistor A resistor is a passive two-terminal electrical component that implements electrical resistance as a circuit element. Resistors act to reduce current flow, and, at the same time, act to lower voltage levels within circuits. - Wikipedia; PROD_ID: RES-00824
R2 R3 = SparkFun-Resistors:5.1KOHM; PROD_ID: RES-12083
R4 R5 R9 = SparkFun-Resistors:4.7KOHM: 4.7kΩ resistor A resistor is a passive two-terminal electrical component that implements electrical resistance as a circuit element. Resistors act to reduce current flow, and, at the same time, act to lower voltage levels within circuits. - Wikipedia; PROD_ID: RES-07857
R10 = SparkFun-Resistors:240OHM: 240Ω resistor A resistor is a passive two-terminal electrical component that implements electrical resistance as a circuit element. Resistors act to reduce current flow, and, at the same time, act to lower voltage levels within circuits. - Wikipedia; PROD_ID: RES-07849
R11 = SparkFun-Resistors:715OHM: 715Ω resistor A resistor is a passive two-terminal electrical component that implements electrical resistance as a circuit element. Resistors act to reduce current flow, and, at the same time, act to lower voltage levels within circuits. - Wikipedia; PROD_ID: RES-07850
R16 R18 R20 R25 R27 = SparkFun-Resistors:47KOHM: 47kΩ resistor A resistor is a passive two-terminal electrical component that implements electrical resistance as a circuit element. Resistors act to reduce current flow, and, at the same time, act to lower voltage levels within circuits. - Wikipedia; PROD_ID: RES-07871
R21 = SparkFun-Resistors:1KOHM: 1kΩ resistor A resistor is a passive two-terminal electrical component that implements electrical resistance as a circuit element. Resistors act to reduce current flow, and, at the same time, act to lower voltage levels within circuits. - Wikipedia; PROD_ID: RES-07856
R22 = SparkFun-Resistors:2.0KOHM: 2kΩ resistor A resistor is a passive two-terminal electrical component that implements electrical resistance as a circuit element. Resistors act to reduce current flow, and, at the same time, act to lower voltage levels within circuits. - Wikipedia; PROD_ID: RES-08296
R28 R29 = SparkFun-Resistors:2.2KOHM: 2.2kΩ resistor A resistor is a passive two-terminal electrical component that implements electrical resistance as a circuit element. Resistors act to reduce current flow, and, at the same time, act to lower voltage levels within circuits. - Wikipedia; PROD_ID: RES-08272
S1 S2 = SparkFun-Switches:MOMENTARY-SWITCH-SPST: Momentary Switch (Pushbutton) - SPST Normally-open (NO) SPST momentary switches (buttons, pushbuttons). Variants PTH-12MM - 12mm square, through-hole Momentary Pushbutton Switch - 12mm Square <https://www.sparkfun.com/products/9190> (COM-09190) PTH-6.0MM, PTH-6.0MM-KIT - 6.0mm square, through-hole Mini Pushbutton Switch <https://www.sparkfun.com/products/97> (COM-00097) KIT package intended for soldering kit's - only one side of pads' copper is exposed. PTH-RIGHT-ANGLE-KIT - Right-angle, through-hole Right Angle Tactile Button <https://www.sparkfun.com/products/10791> - Used on SparkFun BigTime Watch Kit <https://www.sparkfun.com/products/11734> SMD-12MM - 12mm square, surface-mount Tactile Button - SMD (12mm) <https://www.sparkfun.com/products/12993> (COM-12993) Used on SparkFun PicoBoard <https://www.sparkfun.com/products/11888> SMD-4.5MM - 4.5mm Square Trackball Switch Used on SparkFun Blackberry Trackballer Breakout <https://www.sparkfun.com/products/13169> SMD-4.6MMX2.8MM - 4.60mm x 2.80mm, surface mount Used on SparkFun Pro Micro - RP2040 <https://www.sparkfun.com/products/17717> SMD-5.2MM, SMD-5.2-REDUNDANT - 5.2mm square, surface-mount Mini Pushbutton Switch - SMD <https://www.sparkfun.com/products/8720> (COM-08720) Used on Arduino Pro Mini <https://www.sparkfun.com/products/11114> REDUNDANT package connects both switch circuits together SMD-6.0X3.5MM - 6.0 x 3.5mm, surface mount Momentary Reset Switch SMD <https://www.sparkfun.com/products/8229> (COM-08229) SMD-6.2MM-TALL - 6.2mm square, surface mount Tactile Button - SMD (6mm) <https://www.sparkfun.com/products/12992> Used on SparkFun Digital Sandbox <https://www.sparkfun.com/products/12651> SMD-RIGHT-ANGLE - Right-angle, surface mount Used on SparkFun Block for Intel® Edison - Arduino <https://www.sparkfun.com/products/13036>; PROD_ID: SWCH-14139
U1 = SparkFun-RF:ESP-WROOM-32: ESP-WROOM-32D - trace antenna (includes keepout) ESP-WROOM-32U - U.FL antenna connector Includes both "standard" footprints and "narrow" version (for use with tighter layouts).; PROD_ID: IC-15676
U2 = SparkFun-IC-Comms:CH340C; PROD_ID: IC-14038
U3 = SparkFun-IC-Power:V_REG_LM1117: Voltage Regulator LM1117 Standard adjustable voltage regulator but in SMD form. Spark Fun Electronics SKU : COM-00595; PROD_ID: VREG-08170
U4 = SparkFun-IC-Power:V_REG_AP2112: AP2112 - 600mA CMOS LDO Regulator w/ Enable The AP2112 is CMOS process low dropout linear regulator with enable function, the regulator delivers a guaranteed 600mA (min.) continuous load current. Features Output Voltage Accuracy: ±1.5% Output Current: 600mA (Min.) Foldback Short Current Protection: 50mA Enable Function to Turn ON/OFF VOUT Low Dropout Voltage (3.3V): 250mV (Typ.) @IOUT=600mA Excellent Load Regulation: 0.2%/A (Typ.) Excellent Line Regulation: 0.02%/V (Typ.) Low Quiescent Current: 55μA (Typ.) Low Standby Current: 0.01μA (Typ.) Low Output Noise: 50μVRMS PSRR: 100Hz -65dB, 1kHz -65dB OTSD Protection Stable with 1.0μF Flexible Cap: Ceramic, Tantalum and Aluminum Electrolytic Operation Temperature Range: -40°C to 85°C ESD: MM 400V, HBM 4000V; PROD_ID: VREG-12457
U5 = SparkFun-IC-Power:MCP73831: MCP73831T Li-Ion, Li-Pol Controller Miniature single cell, fully integrated Li-Ion, Li-polymer charge management controller Datasheet <http://ww1.microchip.com/downloads/en/DeviceDoc/20001984g.pdf> SparkFun Products: SparkFun ESP32 Thing <https://www.sparkfun.com/products/13907> SparkFun 9DoF Razor IMU M0 <https://www.sparkfun.com/products/14001>; PROD_ID: IC-09995
U6 = SparkFun-IC-Power:MAX17048: Micropower 1-Cell Li+ ModelGauge SparkFun Products Qduino Mini <https://www.sparkfun.com/products/13614> (DEV-13614); PROD_ID: IC-12551